# EAGLE design protector_new (EAGLE 9.4.2)
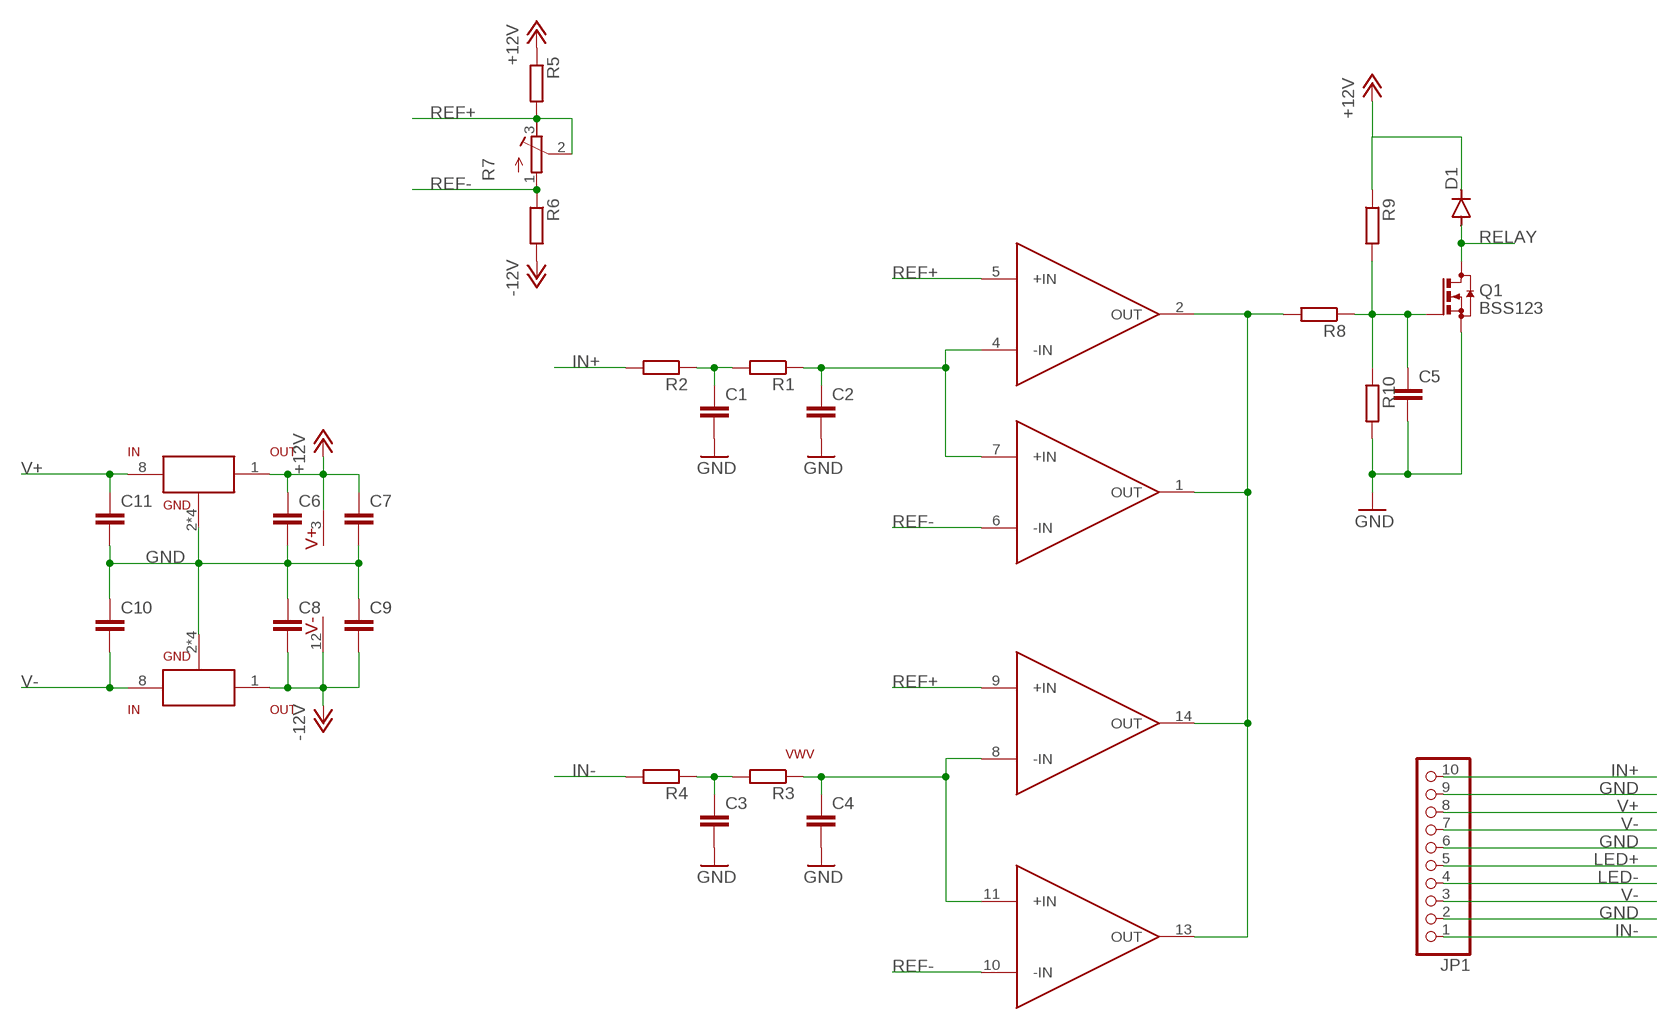
[diagram p0: schematic, sheet 1]

## Parts
C1  C-EUC0805  [C0805]
C2  C-EUC0805  [C0805]
C3  C-EUC0805  [C0805]
C4  C-EUC0805  [C0805]
C5  C-EUC1210  [C1210]
C6  C-EUC0805  [C0805]
C7  C-EUC0805  [C0805]
C8  C-EUC0805  [C0805]
C9  C-EUC0805  [C0805]
C10  C-EUC0805  [C0805]
C11  C-EUC0805  [C0805]
D1  DIODE-SOD80C  [SOD80C]
JP1  PINHD-1X10/90  [1X10/90]
Q1  BSS123  [SOT23]
R1  R-EU_MELF0204W  [MINI_MELF-0204W]
R2  R-EU_MELF0204W  [MINI_MELF-0204W]
R3  R-EU_MELF0204W  [MINI_MELF-0204W]
R4  R-EU_MELF0204W  [MINI_MELF-0204W]
R5  R-EU_MELF0204W  [MINI_MELF-0204W]
R6  R-EU_MELF0204W  [MINI_MELF-0204W]
R7  R-TRIMM3296W  [RTRIM3296W]
R8  R-EU_MELF0204W  [MINI_MELF-0204W]
R9  R-EU_MELF0204W  [MINI_MELF-0204W]
R10  R-EU_MELF0204W  [MINI_MELF-0204W]
U$1  VWV  [VWV]
U$2  TLV1704TSSOP14  [TSSOP14]
U$3  MC78XXSOIC-8  [SO8]
U$4  MC79XXSOIC-8  [SO8]

## Nets
+12V: C6.1 C7.1 D1.C R5.1 R9.1 U$2.3(V+) U$3.1(OUT)
-12V: C8.2 C9.2 R6.2 U$2.12(V-) U$4.1(OUT)
GND: C1.2 C2.2 C3.2 C4.2 C5.2 C6.2 C7.2 C8.1 C9.1 C10.1 C11.2 JP1.2 JP1.6 JP1.9 Q1.2(S) R10.2 U$3.2(GND) U$3.3(GND) U$3.6(GND) U$3.7(GND) U$4.2(GND) U$4.3(GND) U$4.6(GND) U$4.7(GND)
IN+: JP1.10 R2.2
IN-: JP1.1 R4.2
LED+: JP1.5
LED-: JP1.4
N$1: C2.1 R1.1 U$2.4(-IN) U$2.7(+IN)
N$2: C4.1 R3.1 U$2.8(-IN) U$2.11(+IN)
N$3: C1.1 R1.2 R2.1
N$4: C5.1 Q1.1(G) R8.1 R9.2 R10.1
N$5: C3.1 R3.2 R4.1
N$9: R8.2 U$2.1(OUT) U$2.2(OUT) U$2.13(OUT) U$2.14(OUT)
REF+: R5.2 R7.2(S) R7.3(E) U$2.5(+IN) U$2.9(+IN)
REF-: R6.1 R7.1(A) U$2.6(-IN) U$2.10(-IN)
RELAY: D1.A Q1.3(D)
V+: C11.1 JP1.8 U$3.8(IN)
V-: C10.2 JP1.3 JP1.7 U$4.8(IN)

## Library data of the parts
C1-C11 = Vwvwbg:C-EU: CAPACITOR, European symbol
D1 = Vwvwbg:DIODE-: DIODE
JP1 = pinhead:PINHD-1X10: PIN HEADER
Q1 = transistor-small-signal:BSS123: N-CHANNEL MOS FET
R1-R6 R8-R10 = Vwvwbg:R-EU_: RESISTOR, European symbol
R7 = Vwvwbg:R-TRIMM: Trimm resistor; SPICEMODEL: X; SPICEPREFIXL: POT
U$1 = Vwvwbg:VWV
U$2 = Vwvwbg:TLV1704
U$3 = Vwvwbg:MC78XX
U$4 = Vwvwbg:MC79XX

## Board
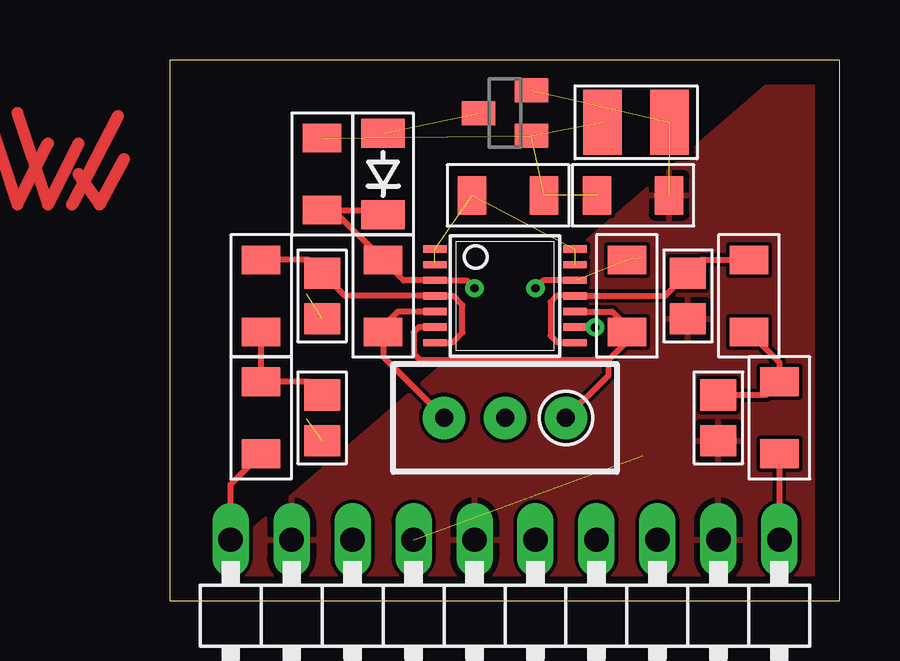
[diagram p1: board, top side]
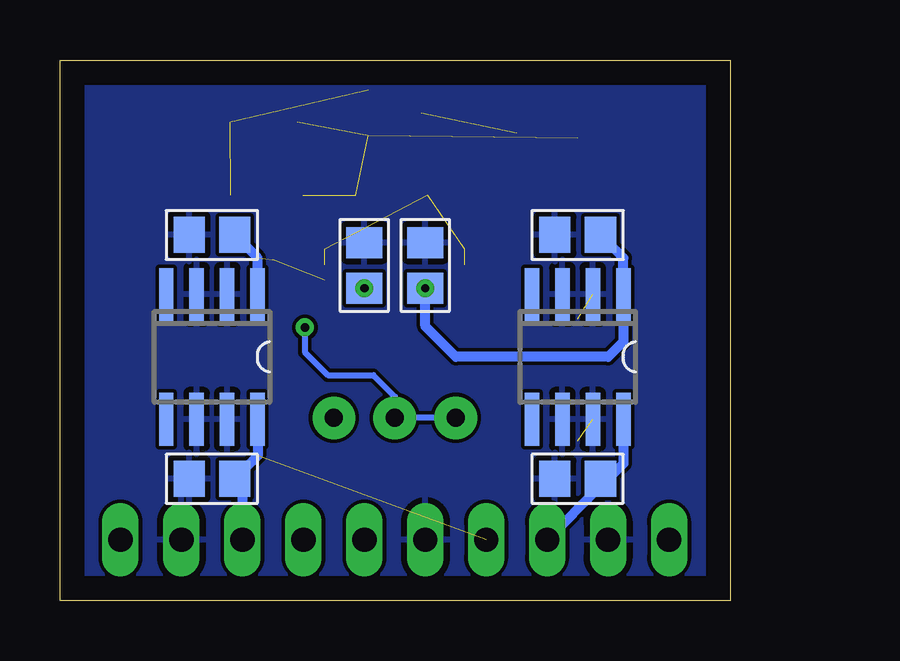
[diagram p2: board, bottom side, seen from below]

Size 27.92 x 22.53 mm. Coordinates in mm from the lower left corner, seen from the top.
Outline: 0,0 27.92,0 27.92,22.53 0,22.53 0,0
Copper layers (1*16): Top 0.035mm / dielectric 0.15mm / Bottom 0.035mm
Design rules "default": minimum track width 6mil, minimum drill 0.35mm, track to track 6mil, track to pad 6mil, pad to pad 6mil, via to via 6mil, smd to smd 6mil, copper to edge 40mil, drill to drill 6mil, minimum pad ring 10mil, minimum via ring 8mil, stop-mask expansion 4mil, vias tented up to drill 0mil, thermal gap 10mil

### Footprints (pad centres in the part's own frame; a part is rotated, then mirrored left to right if it is on the bottom)
C0805 = smd 1.3 x 1.5: 1 -0.95,0; 2 0.95,0
C1210 = smd 1.6 x 2.7: 1 -1.4,0; 2 1.4,0
SOD80C = smd 1.2 x 1.8: A 1.7,0; C -1.7,0
1X10/90 = drill 1.016 long: 1 -11.43,-3.81; 2 -8.89,-3.81; 3 -6.35,-3.81; 4 -3.81,-3.81; 5 -1.27,-3.81; 6 1.27,-3.81; 7 3.81,-3.81; 8 6.35,-3.81; 9 8.89,-3.81; 10 11.43,-3.81
SOT23 = smd 1 x 1.4: 1 -0.95,-1.1; 2 0.95,-1.1; 3 0,1.1
MINI_MELF-0204W = smd 1.2 x 1.6: 1 -1.5,0; 2 1.5,0
RTRIM3296W = drill 0.75 pad 1.778: 1 0,-2.54; 2 0,0; 3 0,2.54
TSSOP14 = smd 0.305 x 0.991: 1 -1.95,-2.918; 2 -1.3,-2.918; 3 -0.65,-2.918; 4 0,-2.918; 5 0.65,-2.918; 6 1.3,-2.918; 7 1.95,-2.918; 8 1.95,2.918; 9 1.3,2.918; 10 0.65,2.918; 11 0,2.918; 12 -0.65,2.918; 13 -1.3,2.918; 14 -1.95,2.918
SO8 = smd 0.6 x 2.2: 1 -1.905,-2.6; 2 -0.635,-2.6; 3 0.635,-2.6; 4 1.905,-2.6; 5 1.905,2.6; 6 0.635,2.6; 7 -0.635,2.6; 8 -1.905,2.6

### Placement (x,y rotation side)
C1  6.35,7.62 270 top
C2  6.35,12.7 270 top
C3  22.86,7.62 270 top
C4  21.59,12.7 270 top
C5  19.43,19.94 0 top
C6  6.35,15.24 180 bottom
C7  12.7,13.97 90 bottom
C8  15.24,13.97 270 bottom
C9  21.59,15.24 0 bottom
C10  21.59,5.08 0 bottom
C11  6.35,5.08 180 bottom
D1  8.89,17.78 90 top
JP1  13.97,-1.27 180 top
Q1  13.97,20.32 90 top
R1  3.81,12.7 270 top
R2  3.81,7.62 270 top
R3  24.13,12.7 270 top
R4  25.4,7.62 270 top
R5  8.89,12.7 270 top
R6  19.05,12.7 90 top
R7  13.97,7.62 90 top
R8  14.1,16.89 180 top
R9  6.35,17.78 90 top
R10  19.3,16.89 0 top
U$1  -5.08,16.51 0 top  (outside the outline)
U$2  13.97,12.7 270 top
U$3  6.35,10.16 180 bottom
U$4  21.59,10.16 180 bottom

### Tracks (layer width: path | path; a pad name or v marks a point on that pad's centre or on a via)
+12V  (via drill 0.35)
  Top 0.254: C7.1 12.37,13.35 U$2.3 9.74,13.35 R5.1 6.81,16.28 R9.1 8.69,16.28 D1.C
  Bottom 0.406: C6.1 4.45,14.29 U$3.1 4.45,10.79 5.08,10.16 11.43,10.16 12.7,11.43 C7.1
  other vias: 12.7,13.02
-12V  (via drill 0.35)  (2 unrouted)
  Top 0.254: U$2.12 15.57,13.35 C8.2
  Bottom 0.406: U$4.1 19.68,14.29 C9.2
  other vias: 15.24,13.02
GND  (4 unrouted)
  pour Top: 27.94,24.13 27.94,24.13 27.94,0 0,0
  pour Bottom: 0,24.13 27.94,24.13 27.94,0 0,0
IN+
  Top 0.254: JP1.10 2.54,4.85 R2.2
IN-
  Top 0.254: R4.2 JP1.1
N$1
  Top 0.254: U$2.7 11.77,10.75 12.19,11.18 12.19,12.32 11.81,12.7 U$2.4 7.3,12.7 C2.1 5.8,14.2 R1.1
N$2
  Top 0.254: U$2.8 16.17,10.75 15.88,11.05 15.88,12.45 16.13,12.7 U$2.11 20.64,12.7 C4.1 22.14,14.2 R3.1
N$3
  Top 0.254: C1.1 5.8,9.12 R2.1 R1.2
N$4  (4 unrouted)
N$5
  Top 0.254: R3.2 25.4,9.93 R4.1 24.85,8.57 C3.1
N$9  (4 unrouted)
REF+  (via drill 0.35)
  Top 0.254: U$2.5 9.51,12.05 8.89,11.43 | U$2.9 v17.71,11.4 v17.72,11.39 | R5.2 8.89,10.16 R7.3
  Top 0.508: 8.89,11.43 R5.2
  Bottom 0.254: v17.72,11.39 17.72,10.35 16.76,9.4 14.86,9.4 13.97,8.51 R7.2 R7.3
REF-
  Top 0.254: U$2.10 18.43,12.05 19.05,11.43 R6.1 19.05,10.79 18.29,10.03 | U$2.6 10.38,11.4 10.16,11.18 10.16,10.29 10.41,10.03 18.29,10.03 | R7.1 18.29,9.4 18.29,10.03
RELAY  (1 unrouted)
V+
  Bottom 0.406: JP1.8 5.4,4.76 C11.1 5.08,5.08 4.45,5.71 U$3.8
V-  (1 unrouted)
  Bottom 0.406: U$4.8 19.68,6.04 C10.2 20.32,4.76 JP1.3